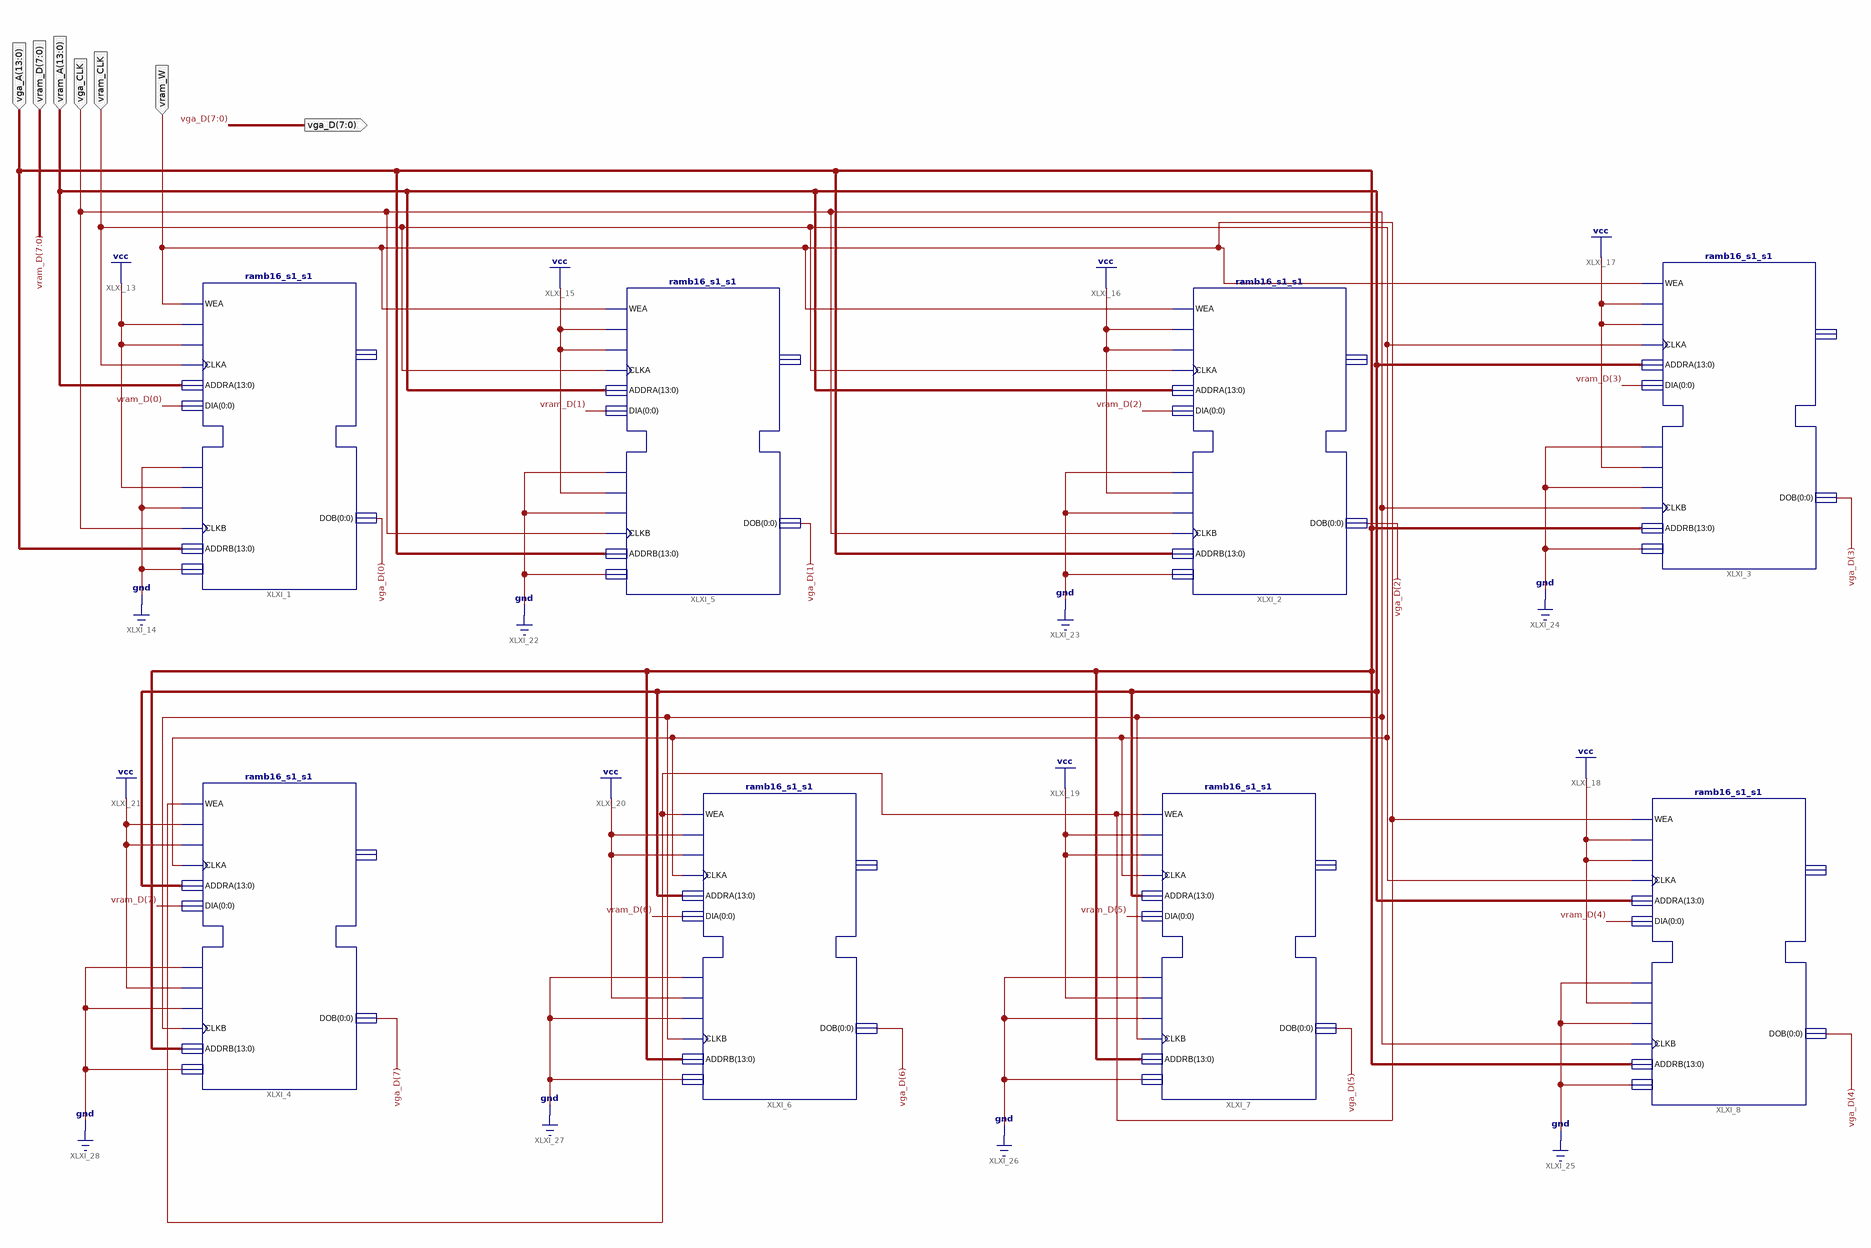
[diagram p0: schematic sheet 1]
// Xilinx ISE schematic VRAM_Amstrad.sch (artix7) as structural Verilog: 8 symbols, 7 ports
module VRAM_Amstrad (
  input  vram_CLK,
  input  vga_CLK,
  input  [13:0] vram_A,
  input  [13:0] vga_A,
  input  vram_W,
  input  [7:0] vram_D,
  output [7:0] vga_D
);

  ramb16_s1_s1 #(.WRITE_MODE_B("WRITE_FIRST"), .WRITE_MODE_A("WRITE_FIRST")) XLXI_4 (
    .ADDRA(vram_A), .ADDRB(vga_A), .CLKA(vram_CLK), .CLKB(vga_CLK), .DIA(vram_D[7]), .DIB(1'b0), .ENA(1'b1),
    .ENB(1'b1), .SSRA(1'b1), .SSRB(1'b0), .WEA(vram_W), .WEB(1'b0), .DOB(vga_D[7]));  // open: DOA
  ramb16_s1_s1 #(.WRITE_MODE_B("WRITE_FIRST"), .WRITE_MODE_A("WRITE_FIRST")) XLXI_6 (
    .ADDRA(vram_A), .ADDRB(vga_A), .CLKA(vram_CLK), .CLKB(vga_CLK), .DIA(vram_D[6]), .DIB(1'b0), .ENA(1'b1),
    .ENB(1'b1), .SSRA(1'b1), .SSRB(1'b0), .WEA(vram_W), .WEB(1'b0), .DOB(vga_D[6]));  // open: DOA
  ramb16_s1_s1 #(.WRITE_MODE_B("WRITE_FIRST"), .WRITE_MODE_A("WRITE_FIRST")) XLXI_7 (
    .ADDRA(vram_A), .ADDRB(vga_A), .CLKA(vram_CLK), .CLKB(vga_CLK), .DIA(vram_D[5]), .DIB(1'b0), .ENA(1'b1),
    .ENB(1'b1), .SSRA(1'b1), .SSRB(1'b0), .WEA(vram_W), .WEB(1'b0), .DOB(vga_D[5]));  // open: DOA
  ramb16_s1_s1 #(.WRITE_MODE_B("WRITE_FIRST"), .WRITE_MODE_A("WRITE_FIRST")) XLXI_8 (
    .ADDRA(vram_A), .ADDRB(vga_A), .CLKA(vram_CLK), .CLKB(vga_CLK), .DIA(vram_D[4]), .DIB(1'b0), .ENA(1'b1),
    .ENB(1'b1), .SSRA(1'b1), .SSRB(1'b0), .WEA(vram_W), .WEB(1'b0), .DOB(vga_D[4]));  // open: DOA
  ramb16_s1_s1 #(.WRITE_MODE_B("WRITE_FIRST"), .WRITE_MODE_A("WRITE_FIRST")) XLXI_1 (
    .ADDRA(vram_A), .ADDRB(vga_A), .CLKA(vram_CLK), .CLKB(vga_CLK), .DIA(vram_D[0]), .DIB(1'b0), .ENA(1'b1),
    .ENB(1'b1), .SSRA(1'b1), .SSRB(1'b0), .WEA(vram_W), .WEB(1'b0), .DOB(vga_D[0]));  // open: DOA
  ramb16_s1_s1 #(.WRITE_MODE_B("WRITE_FIRST"), .WRITE_MODE_A("WRITE_FIRST")) XLXI_5 (
    .ADDRA(vram_A), .ADDRB(vga_A), .CLKA(vram_CLK), .CLKB(vga_CLK), .DIA(vram_D[1]), .DIB(1'b0), .ENA(1'b1),
    .ENB(1'b1), .SSRA(1'b1), .SSRB(1'b0), .WEA(vram_W), .WEB(1'b0), .DOB(vga_D[1]));  // open: DOA
  ramb16_s1_s1 #(.WRITE_MODE_B("WRITE_FIRST"), .WRITE_MODE_A("WRITE_FIRST")) XLXI_2 (
    .ADDRA(vram_A), .ADDRB(vga_A), .CLKA(vram_CLK), .CLKB(vga_CLK), .DIA(vram_D[2]), .DIB(1'b0), .ENA(1'b1),
    .ENB(1'b1), .SSRA(1'b1), .SSRB(1'b0), .WEA(vram_W), .WEB(1'b0), .DOB(vga_D[2]));  // open: DOA
  ramb16_s1_s1 #(.WRITE_MODE_B("WRITE_FIRST"), .WRITE_MODE_A("WRITE_FIRST")) XLXI_3 (
    .ADDRA(vram_A), .ADDRB(vga_A), .CLKA(vram_CLK), .CLKB(vga_CLK), .DIA(vram_D[3]), .DIB(1'b0), .ENA(1'b1),
    .ENB(1'b1), .SSRA(1'b1), .SSRB(1'b0), .WEA(vram_W), .WEB(1'b0), .DOB(vga_D[3]));  // open: DOA
endmodule
